# Altium project Carte_MiniPAMI 2024.PrjPcb
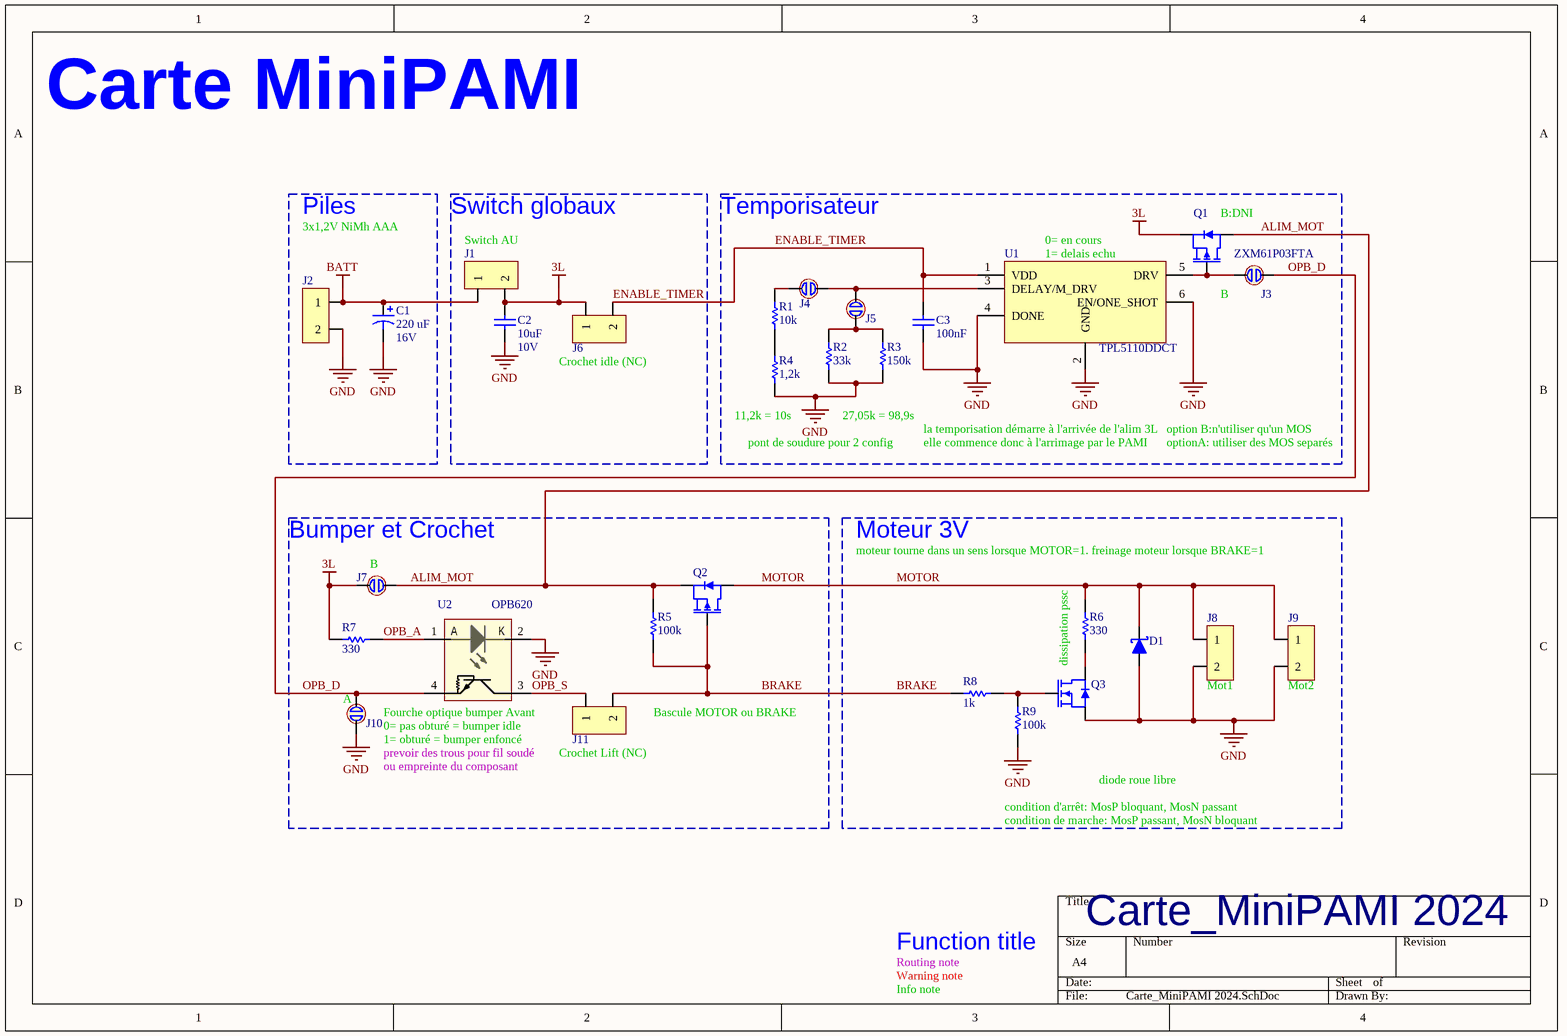
[diagram p0: Carte_MiniPAMI 2024.SchDoc]
1 sheet, 29 parts. Net scope: global (net labels, ports and power ports of the same name join across sheets).
Board file: Carte_MiniPAMI 2024.PcbDoc

## Sheet Carte_MiniPAMI 2024.SchDoc
size A4; Author: Audran; CompanyName: Goldorak; Address1: Electrolab; Address2: 52 rue Paul Lescop; Address3: 92000 Nanterre; DocumentNumber: 1; SheetNumber: 1; SheetTotal: 5; ProjectName: Cartes_2017

### Parts
C1  220 uF  RatedVoltage: 16V  [WCAP-ATG8_6.3x11x2.5x0.5]
C2  10uF  RatedVoltage: 10V  [WCAP-CSGP_0805, 2x1.25x1.25]
C3  100nF  [WCAP-CSGP_0603, 1.6x0.8x0.8]
D1  RBR3MM40ATFTR  [SOD-123FL]  (value not drawn)
J1  22-03-2021  [Conn_22-03-2021]  (value not drawn)
J2  22-03-2021  [Conn_22-03-2021]  (value not drawn)
J3  open  [CAVALIER]  (value not drawn)  (no BOM)
J4  open  [CAVALIER]  (value not drawn)  (no BOM)
J5  open  [CAVALIER]  (value not drawn)  (no BOM)
J6  22-03-2021  [Conn_22-03-2021]  (value not drawn)
J7  open  [CAVALIER]  (value not drawn)  (no BOM)
J8  22-03-2021  [Conn_22-03-2021]  (value not drawn)
J9  22-03-2021  [Conn_22-03-2021]  (value not drawn)
J10  open  [CAVALIER]  (value not drawn)  (no BOM)
J11  22-03-2021  [Conn_22-03-2021]  (value not drawn)
Q1  ZXM61P03FTA  [SOT-23]
Q2  ZXM61P03FTA  [SOT-23]  (value not drawn)
Q3  IRLML0040TRPBF  [SOT-23]  (value not drawn)
R1  value 10k  [RESC1608X06N]  (hidden comment: RC0603FR-0710KL)
R2  value 33k  [RESC1608X06N]
R3  value 150k  [RESC1608X06N]
R4  value 1,2k  [RESC1608X06N]
R5  value 100k  [RESC1608X06N]  (hidden comment: RC0603FR-07100KL)
R6  value 330  [RESC1608X06N]  (hidden comment: RC0603FR-07330RL)
R7  value 330  [RESC1608X06N]  (hidden comment: RC0603FR-07330RL)
R8  value 1k  [RESC1608X06N]  (hidden comment: RC0603FR-071KL)
R9  value 100k  [RESC1608X06N]  (hidden comment: RC0603FR-07100KL)
U1  TPL5110DDCT  [SOT23_95P280X145-6N]
U2  OPB620  [OPB620]

### Blocks framed on the sheet
Piles: C1 J2
Switch globaux: C2 J1 J6
Temporisateur: C3 J3-J5 Q1 R1-R4 U1
Bumper et Crochet: J7 J10 J11 Q2 R5 R7 U2
Moteur 3V: D1 J8 J9 Q3 R6 R8 R9

### Nets
3L: C2.1 J1.2 J6.1 J7.1 Q1.2(S) R7.1
BATT: C1.1 J1.1 J2.1
GND: C1.2 C2.2 C3.2 D1.1 J2.2 J8.2 J9.2 J10.1 Q3.2(S) R2.2 R3.2 R4.1 R9.1 U1.2(GND) U1.4(DONE) U1.6(EN/ONE_SHOT) U2.2(LED_K)
ALIM_MOT: J7.2 Q1.3(D) Q2.2(S) R5.2
BRAKE: J11.2 Q2.1(G) R5.1 R8.2
ENABLE_TIMER: C3.1 J6.2 U1.1(VDD)
MOTOR: D1.2 J8.1 J9.1 Q2.3(D) R6.2
OPB_A: R7.2 U2.1(LED_A)
OPB_D: J3.2 J10.2 U2.4(NPN_E)
OPB_S: J11.1 U2.3(NPN_C)
NetJ3_1: J3.1 Q1.1(G) U1.5(DRV)
NetJ4_1: J4.1 R1.2
NetJ4_2: J4.2 J5.2 U1.3(DELAY/M_DRV)
NetJ5_1: J5.1 R2.1 R3.1
NetQ3_1: Q3.1(G) R8.1 R9.2
NetQ3_3: Q3.3(D) R6.1
NetR1_1: R1.1 R4.2

### Notes on the sheet
- Carte MiniPAMI
- 3x1,2V NiMh AAA
- (near J1) Switch AU
- (near U1) 0= en cours
- (near Q1) B:DNI
- (near U1) 1= delais echu
- B
- Crochet idle (NC)
- (near R4) 11,2k = 10s
- pont de soudure pour 2 config
- 27,05k = 98,9s
- la temporisation démarre à l'arrivée de l'alim 3L
- elle commence donc à l'arrimage par le PAMI
- option B:n'utiliser qu'un MOS
- optionA: utiliser des MOS separés
- (near J7) B
- moteur tourne dans un sens lorsque MOTOR=1. freinage moteur lorsque BRAKE=1
- (near J10) A
- (near U2) Fourche optique bumper Avant
- (near J11) Bascule MOTOR ou BRAKE
- dissipation pssc
- (near J8) Mot1
- (near J9) Mot2
- prevoir des trous pour fil soudé
- ou empreinte du composant
- 0= pas obturé = bumper idle
- 1= obturé = bumper enfoncé
- (near J11) Crochet Lift (NC)
- diode roue libre
- condition d'arrêt: MosP bloquant, MosN passant
- condition de marche: MosP passant, MosN bloquant
- Routing note
- Warning note
- Function title
- Carte_MiniPAMI 2024
- Info note
- (in symbol OPB620) A; K

### Library data of the parts
C1 = WCAP-ATG8, 860010373010: CAP Alu 220 UF 20% 16 V; Manufacturer: Wurth Elektronik; ComponentLink1Description: Datasheet; ComponentLink1URL: http://katalog.we-online.de/pbs/datasheet/860010373010.pdf; Manufacturer Part Number: 860010373010; Value: 220 uF; Size: 6.3mmx11mm
C2 = WCAP-CSGP, 885012207026: CAP CER 10uF 10V X7R 0805; Manufacturer: Wurth Elektronik; ComponentLink1Description: Datasheet; ComponentLink1URL: http://katalog.we-online.com/pbs/datasheet/885012207026.pdf; Value: 10uF; Size: 0805; CeramicType: X7R; Manufacturer Part Number: 885012207026; Supplier 2: JLCPCB; Supplier Part Number 2: C15850; Supplier 1: Farnell; Supplier Part Number 1: 2495189; Supplier Footprint 2: 0805
C3 = WCAP-CSGP, 885012206095: CAP CER 100nF 50V X7R 0603; Manufacturer: Wurth Elektronik; ComponentLink1Description: Datasheet; ComponentLink1URL: http://katalog.we-online.com/pbs/datasheet/885012206095.pdf; Manufacturer Part Number: 885012206095; Value: 100nF; Size: 0603; CeramicType: X7R; Supplier 2: JLCPCB; Supplier Part Number 2: C14663; RatedVoltage: 50V; Supplier Footprint 2: 0603; Supplier 1: Farnell; Supplier Part Number 1: 2495187
D1 = RBR3MM40ATFTR: DIODE SCHOTTKY 40V 3A SOD123-FL; Manufacturer: ROHM; Supplier 1: Farnell; Manufacturer Part Number: RBR3MM40ATFTR; ComponentLink1URL: http://www.farnell.com/datasheets/2067190.pdf; ComponentLink1Description: Datasheet; Supplier Part Number 1: 2581593; ComponentLink2Description: Manufacturer; ComponentLink2URL: http://www.rohm.com/web/global/products/-/product/RBR3MM40ATF; ContinuousForwardCurrent: 3A; Type: Schottky; Supplier 2: JLCPCB; Supplier Part Number 2: C8598; Value: 40V; Supplier Footprint 2: SOD-123
J1 J2 J6 J8 J9 J11 = Conn_22-03-2021: CONN HEADER VERT 2POS 2.54MM; Manufacturer: MOLEX; Supplier 1: Farnell; Supplier Part Number 1: 9731075; Manufacturer Part Number: 22-03-2021; ComponentLink1URL: http://www.farnell.com/datasheets/1791308.pdf; ComponentLink1Description: Datasheet; ComponentLink2URL: http://www.farnell.com/cad/495071.pdf  http://www.farnell.com/cad/1533907.pdf  http://www.farnell.com/cad/1533907.pdf; ComponentLink2Description: Drawings
J3-J5 J7 J10 = CAVALIER_DOT: Cavalier soudure "ouvert", pastille fendue 1.2mm
Q1 Q2 = ZXM61P03FTA: MOSFET P-CH 30V 1.1A SOT23-3; Manufacturer: Diodes Incorporated; Manufacturer Part Number: ZXM61P03FTA; ComponentLink1Description: Datasheet; ComponentLink1URL: https://www.diodes.com/assets/Datasheets/ZXM61P03F.pdf; Supplier Footprint 2: SOT-23-3; Supplier 2: JLCPCB; Supplier 1: Rs; Supplier Part Number 2: C156274; Supplier Part Number 1: 9227673; Supplier 3: Evolutek
Q3 = IRLML0040: MOSFET N 40V 3.6A SOT23; Manufacturer: INTERNATIONAL RECTIFIER; Supplier 1: Farnell; Supplier Part Number 1: 1831088; Manufacturer Part Number: IRLML0040TRPBF; ComponentLink1Description: Datasheet; ComponentLink1URL: http://www.irf.com/product-info/datasheets/data/irlml0040pbf.pdf
R1 = RC0603FR-0710KL: RES SMD 10K OHM 1% 1/10W 0603; Manufacturer: Yageo; Power: 100mW; Vmax: 50V; Manufacturer Part Number: RC0603FR-0710KL; Type: Thick Film; ComponentLink1Description: Manufacturer; ComponentLink1URL: http://www.yageo.com/NewPortal/_en/index.jsp; ComponentLink2Description: Datasheet; ComponentLink2URL: http://www.farnell.com/datasheets/2167052.pdf; Supplier 1: Farnell; Supplier Part Number 1: 9238603; Precision: ±1%; Supplier 2: JLCPCB; Supplier Part Number 2: C25804; Supplier Footprint 2: 0603
R2 = RC0603FR-0710KL: RES SMD 33K OHM 1% 1/10W 0603; Manufacturer: Yageo; Power: 100mW; Vmax: 50V; Type: Thick Film; ComponentLink1Description: Manufacturer; ComponentLink1URL: http://www.yageo.com/NewPortal/_en/index.jsp; ComponentLink2Description: Datasheet; ComponentLink2URL: http://www.farnell.com/datasheets/2167052.pdf; Supplier 1: Farnell; Supplier Part Number 1: 9238603; Precision: ±1%; Supplier 2: JLCPCB; Supplier Part Number 2: C25804; Supplier Footprint 2: 0603
R3 = RC0603FR-07100KL: RES SMD 150K OHM 1% 1/10W 0603; Manufacturer: Yageo; Power: 100mW; Vmax: 50V; Type: Thick Film; ComponentLink1Description: Manufacturer; ComponentLink1URL: http://www.yageo.com/NewPortal/_en/index.jsp; ComponentLink2Description: Datasheet; ComponentLink2URL: http://www.farnell.com/datasheets/2167052.pdf; Supplier 1: Farnell; Supplier Part Number 1: 2309107; Precision: ±1%; Supplier 2: JLCPCB; Supplier Part Number 2: C25803; Supplier Footprint 2: 0603
R4 = RC0603FR-071KL: RES SMD 1,2K OHM 1% 1/10W 0603; Manufacturer: Yageo; Power: 100mW; Vmax: 50V; Type: Thick Film; ComponentLink1Description: Manufacturer; ComponentLink1URL: http://www.yageo.com/NewPortal/_en/index.jsp; ComponentLink2Description: Datasheet; ComponentLink2URL: http://www.farnell.com/datasheets/2167052.pdf; Precision: ±1%; Supplier 1: Farnell; Supplier 2: JLCPCB; Supplier Footprint 2: 0603
R5 R9 = RC0603FR-07100KL: RES SMD 100K OHM 1% 1/10W 0603; Manufacturer: Yageo; Power: 100mW; Vmax: 50V; Manufacturer Part Number: RC0603FR-07100KL; Type: Thick Film; ComponentLink1Description: Manufacturer; ComponentLink1URL: http://www.yageo.com/NewPortal/_en/index.jsp; ComponentLink2Description: Datasheet; ComponentLink2URL: http://www.farnell.com/datasheets/2167052.pdf; Supplier 1: Farnell; Supplier Part Number 1: 2309107; Precision: ±1%; Supplier 2: JLCPCB; Supplier Part Number 2: C25803; Supplier Footprint 2: 0603
R6 R7 = RC0603FR-07330RL: RES SMD 330 OHM 1% 1/10W 0603; Manufacturer: Yageo; Power: 100mW; Vmax: 50V; Manufacturer Part Number: RC0603FR-07330RL; Type: Thick Film; ComponentLink1Description: Manufacturer; ComponentLink1URL: http://www.yageo.com/NewPortal/_en/index.jsp; ComponentLink2Description: Datasheet; ComponentLink2URL: http://www.farnell.com/datasheets/2167052.pdf; Supplier 1: Farnell; Supplier Part Number 1: 9238425; Precision: ±1%; Supplier 2: JLCPCB; Supplier Part Number 2: C23138; Supplier Footprint 2: 0603
R8 = RC0603FR-071KL: RES SMD 1K OHM 1% 1/10W 0603; Manufacturer: Yageo; Power: 100mW; Vmax: 50V; Manufacturer Part Number: RC0603FR-071KL; Type: Thick Film; ComponentLink1Description: Manufacturer; ComponentLink1URL: http://www.yageo.com/NewPortal/_en/index.jsp; ComponentLink2Description: Datasheet; ComponentLink2URL: http://www.farnell.com/datasheets/2167052.pdf; Precision: ±1%; Supplier 1: Farnell; Supplier Part Number 1: 9238484; Supplier 2: JLCPCB; Supplier Part Number 2: C21190; Supplier Footprint 2: 0603
U1 = TPL5110DDCT: IC OSC PROG TIMER TSOT23-6; Manufacturer: TEXAS INSTRUMENTS; ComponentLink1URL: https://www.ti.com/lit/ds/symlink/tpl5110.pdf; ComponentLink1Description: Datasheet; Manufacturer Part Number: TPL5110DDCT; Supplier 1: Farnell; Supplier Part Number 1: 3121221; Supplier 2: LCSC; Supplier Part Number 2: C125830
U2 = OPB620: SENSOR OPT SLOT TRANS W/RES PCB; Manufacturer: TT ELECTRONICS; Manufacturer Part Number: OPB620; ComponentLink1URL: http://www.farnell.com/datasheets/2702441.pdf; ComponentLink1Description: Datasheet; Supplier 1: Farnell; Supplier Part Number 1: 491330

## Assembly variants
PROD: not fitted D1 J1 J2 J4 J10 Q1